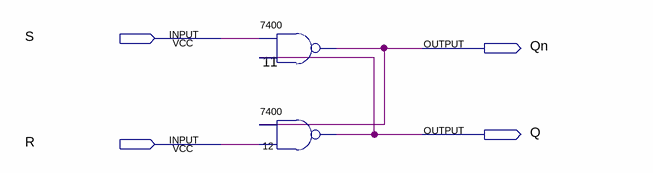
[diagram p0: schematic sheet]
// Quartus schematic Problem2.bdf as structural Verilog: 2 symbols, 4 pins
module Problem2 (
  input  S,
  input  R,
  output Qn,
  output Q
);

  \7400  u_11 (.\3 (Q), .\2 (S), .\1 (Qn));
  \7400  u_12 (.\3 (R), .\2 (Qn), .\1 (Q));
endmodule
